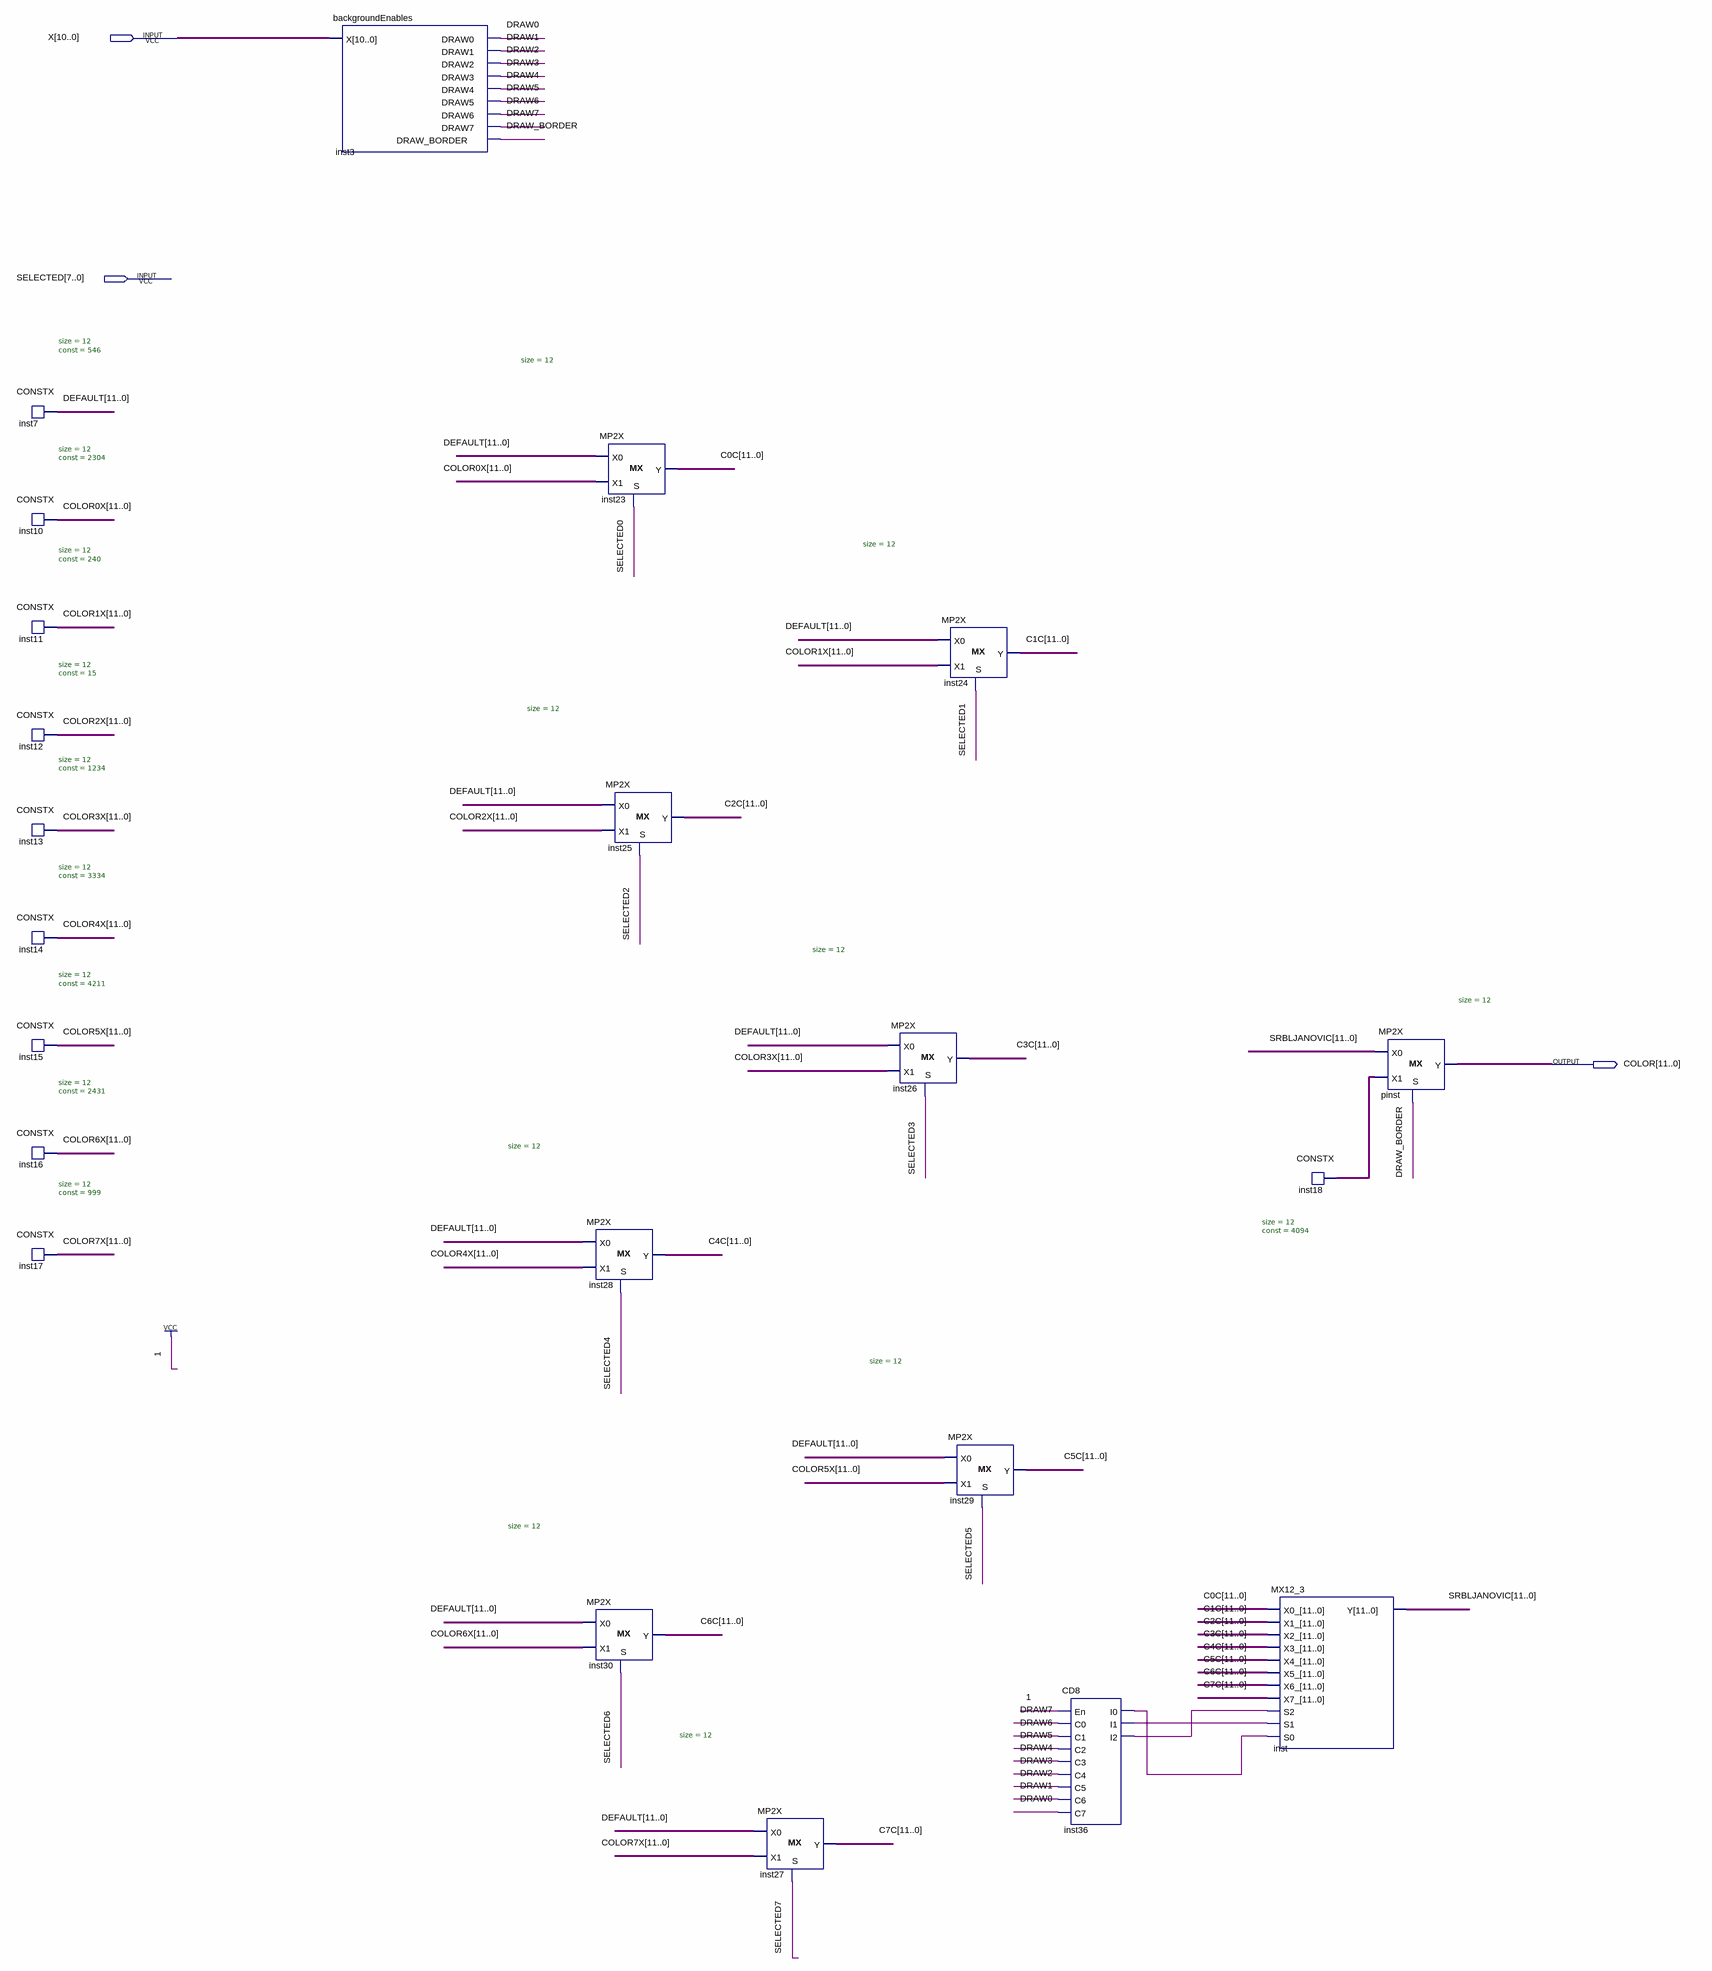
[diagram p0: schematic sheet]
// Quartus schematic backgroundLayer.bdf as structural Verilog: 22 symbols, 3 pins
module backgroundLayer (
  input  [10:0] X,
  input  [7:0] SELECTED,
  output [11:0] COLOR
);

  wire DRAW0, DRAW1, DRAW2, DRAW3, DRAW4, DRAW5, DRAW6, DRAW7, DRAW_BORDER, inst36_i0, inst36_i1, inst36_i2;
  wire [11:0] C0C, C1C, C2C, C3C, C4C, C5C, C6C, C7C, COLOR0X, COLOR1X, COLOR2X, COLOR3X, COLOR4X, COLOR5X,
       COLOR6X, COLOR7X, DEFAULT, inst18_data, SRBLJANOVIC;

  CONSTX #(.size(12), .\const (546)) inst7 (.data(DEFAULT));
  CONSTX #(.size(12), .\const (2304)) inst10 (.data(COLOR0X));
  CONSTX #(.size(12), .\const (240)) inst11 (.data(COLOR1X));
  CONSTX #(.size(12), .\const (15)) inst12 (.data(COLOR2X));
  CONSTX #(.size(12), .\const (1234)) inst13 (.data(COLOR3X));
  CONSTX #(.size(12), .\const (3334)) inst14 (.data(COLOR4X));
  CONSTX #(.size(12), .\const (4211)) inst15 (.data(COLOR5X));
  CONSTX #(.size(12), .\const (2431)) inst16 (.data(COLOR6X));
  CONSTX #(.size(12), .\const (999)) inst17 (.data(COLOR7X));
  backgroundEnables inst3 (
    .X(X), .DRAW0(DRAW0), .DRAW1(DRAW1), .DRAW2(DRAW2), .DRAW3(DRAW3), .DRAW4(DRAW4), .DRAW5(DRAW5),
    .DRAW6(DRAW6), .DRAW7(DRAW7), .DRAW_BORDER(DRAW_BORDER));
  MP2X #(.size(12)) inst23 (.S(SELECTED[0]), .X0(DEFAULT), .X1(COLOR0X), .Y(C0C));
  MP2X #(.size(12)) inst25 (.S(SELECTED[2]), .X0(DEFAULT), .X1(COLOR2X), .Y(C2C));
  MP2X #(.size(12)) inst28 (.S(SELECTED[4]), .X0(DEFAULT), .X1(COLOR4X), .Y(C4C));
  MP2X #(.size(12)) inst30 (.S(SELECTED[6]), .X0(DEFAULT), .X1(COLOR6X), .Y(C6C));
  MP2X #(.size(12)) inst27 (.S(SELECTED[7]), .X0(DEFAULT), .X1(COLOR7X), .Y(C7C));
  MP2X #(.size(12)) inst26 (.S(SELECTED[3]), .X0(DEFAULT), .X1(COLOR3X), .Y(C3C));
  MP2X #(.size(12)) inst24 (.S(SELECTED[1]), .X0(DEFAULT), .X1(COLOR1X), .Y(C1C));
  MP2X #(.size(12)) inst29 (.S(SELECTED[5]), .X0(DEFAULT), .X1(COLOR5X), .Y(C5C));
  CD8 inst36 (
    .En(1'b1), .C0(DRAW7), .C1(DRAW6), .C2(DRAW5), .C3(DRAW4), .C4(DRAW3), .C5(DRAW2), .C6(DRAW1),
    .C7(DRAW0), .I0(inst36_i0), .I1(inst36_i1), .I2(inst36_i2));
  CONSTX #(.size(12), .\const (4094)) inst18 (.data(inst18_data));
  MX12_3 inst (
    .X0_(C0C), .X1_(C1C), .X2_(C2C), .X3_(C3C), .X4_(C4C), .X5_(C5C), .X6_(C6C), .X7_(C7C), .S2(inst36_i2),
    .S1(inst36_i1), .S0(inst36_i0), .Y(SRBLJANOVIC));
  MP2X #(.size(12)) pinst (.S(DRAW_BORDER), .X0(SRBLJANOVIC), .X1(inst18_data), .Y(COLOR));
endmodule
